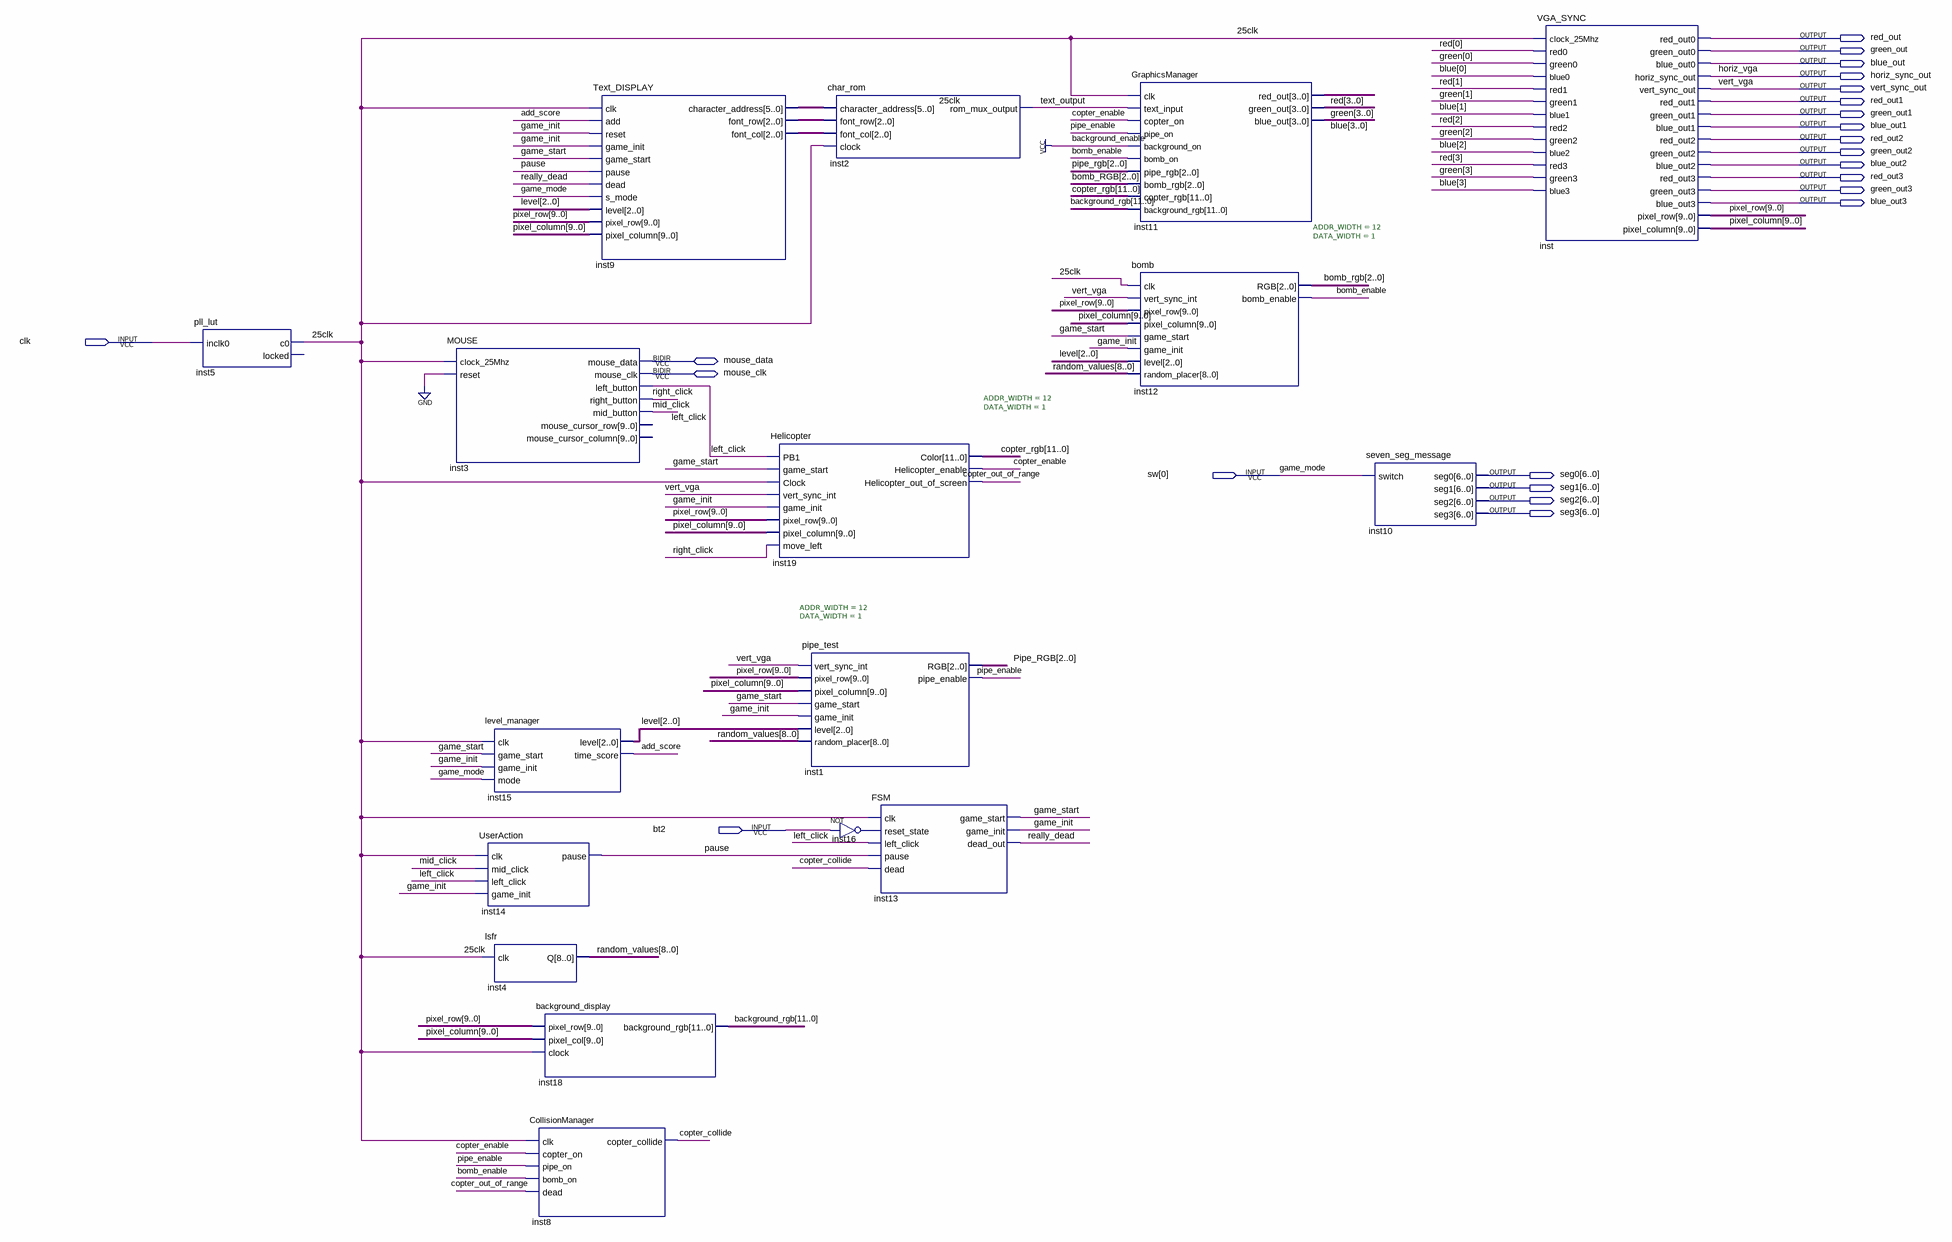
[diagram p0: schematic sheet]
// Quartus schematic 305_project.bdf as structural Verilog: 17 symbols, 23 pins
module \305_project  (
  input  clk,
  input  [0:0] sw,
  input  bt2,
  inout  mouse_data,
  inout  mouse_clk,
  output red_out,
  output green_out,
  output blue_out,
  output horiz_sync_out,
  output vert_sync_out,
  output red_out1,
  output green_out1,
  output blue_out1,
  output red_out2,
  output green_out2,
  output blue_out2,
  output red_out3,
  output green_out3,
  output blue_out3,
  output [6:0] seg0,
  output [6:0] seg1,
  output [6:0] seg2,
  output [6:0] seg3
);

  wire \25clk , add_score, bomb_enable, copter_collide, copter_enable, copter_out_of_range, game_init,
       game_start, inst16_out, left_click, mid_click, pause, pipe_enable, really_dead, right_click,
       text_output;
  wire [2:0] bomb_rgb, inst9_font_col, inst9_font_row, level, Pipe_RGB;
  wire [3:0] blue, green, red;
  wire [5:0] inst9_character_address;
  wire [8:0] random_values;
  wire [9:0] pixel_column, pixel_row;
  wire [11:0] background_rgb, copter_rgb;

  pll_lut inst5 (.inclk0(clk), .c0(\25clk ));  // open: locked
  MOUSE inst3 (
    .clock_25Mhz(\25clk ), .reset(1'b0), .left_button(left_click), .right_button(right_click),
    .mid_button(mid_click), .mouse_data(mouse_data), .mouse_clk(mouse_clk));  // open: mouse_cursor_row, mouse_cursor_column
  level_manager inst15 (
    .clk(\25clk ), .game_start(game_start), .game_init(game_init), .mode(sw[0]), .level(level),
    .time_score(add_score));
  UserAction inst14 (
    .clk(\25clk ), .mid_click(mid_click), .left_click(left_click), .game_init(game_init), .pause(pause));
  lsfr inst4 (.clk(\25clk ), .Q(random_values));
  background_display inst18 (
    .pixel_row(pixel_row), .pixel_col(pixel_column), .clock(\25clk ), .background_rgb(background_rgb));
  CollisionManager inst8 (
    .clk(\25clk ), .copter_on(copter_enable), .pipe_on(pipe_enable), .bomb_on(bomb_enable),
    .dead(copter_out_of_range), .copter_collide(copter_collide));
  Text_DISPLAY inst9 (
    .clk(\25clk ), .add(add_score), .reset(game_init), .game_init(game_init), .game_start(game_start),
    .pause(pause), .dead(really_dead), .s_mode(sw[0]), .level(level), .pixel_row(pixel_row),
    .pixel_column(pixel_column), .character_address(inst9_character_address), .font_row(inst9_font_row),
    .font_col(inst9_font_col));
  Helicopter #(.ADDR_WIDTH(12), .DATA_WIDTH(1)) inst19 (
    .PB1(left_click), .game_start(game_start), .Clock(\25clk ), .vert_sync_int(vert_sync_out),
    .game_init(game_init), .pixel_row(pixel_row), .pixel_column(pixel_column), .move_left(right_click),
    .Color(copter_rgb), .Helicopter_enable(copter_enable), .Helicopter_out_of_screen(copter_out_of_range));
  pipe_test #(.ADDR_WIDTH(12), .DATA_WIDTH(1)) inst1 (
    .vert_sync_int(vert_sync_out), .pixel_row(pixel_row), .pixel_column(pixel_column),
    .game_start(game_start), .game_init(game_init), .level(level), .random_placer(random_values),
    .RGB(Pipe_RGB), .pipe_enable(pipe_enable));
  char_rom inst2 (
    .character_address(inst9_character_address), .font_row(inst9_font_row), .font_col(inst9_font_col),
    .clock(\25clk ), .rom_mux_output(text_output));
  not inst16 (inst16_out, bt2);
  FSM inst13 (
    .clk(\25clk ), .reset_state(inst16_out), .left_click(left_click), .pause(pause), .dead(copter_collide),
    .game_start(game_start), .game_init(game_init), .dead_out(really_dead));
  GraphicsManager inst11 (
    .clk(\25clk ), .text_input(text_output), .copter_on(copter_enable), .pipe_on(pipe_enable),
    .background_on(1'b1), .bomb_on(bomb_enable), .pipe_rgb(Pipe_RGB), .bomb_rgb(bomb_rgb),
    .copter_rgb(copter_rgb), .background_rgb(background_rgb), .red_out(red), .green_out(green),
    .blue_out(blue));
  bomb #(.ADDR_WIDTH(12), .DATA_WIDTH(1)) inst12 (
    .clk(\25clk ), .vert_sync_int(vert_sync_out), .pixel_row(pixel_row), .pixel_column(pixel_column),
    .game_start(game_start), .game_init(game_init), .level(level), .random_placer(random_values),
    .RGB(bomb_rgb), .bomb_enable(bomb_enable));
  seven_seg_message inst10 (.switch(sw[0]), .seg0(seg0), .seg1(seg1), .seg2(seg2), .seg3(seg3));
  VGA_SYNC inst (
    .clock_25Mhz(\25clk ), .red0(red[0]), .green0(green[0]), .blue0(blue[0]), .red1(red[1]),
    .green1(green[1]), .blue1(blue[1]), .red2(red[2]), .green2(green[2]), .blue2(blue[2]), .red3(red[3]),
    .green3(green[3]), .blue3(blue[3]), .red_out0(red_out), .green_out0(green_out), .blue_out0(blue_out),
    .horiz_sync_out(horiz_sync_out), .vert_sync_out(vert_sync_out), .red_out1(red_out1),
    .green_out1(green_out1), .blue_out1(blue_out1), .red_out2(red_out2), .green_out2(green_out2),
    .blue_out2(blue_out2), .red_out3(red_out3), .green_out3(green_out3), .blue_out3(blue_out3),
    .pixel_row(pixel_row), .pixel_column(pixel_column));

  // Other names for the same wires on the sheet: game_mode = sw[0]; horiz_vga = horiz_sync_out;
  //   vert_vga = vert_sync_out
endmodule
